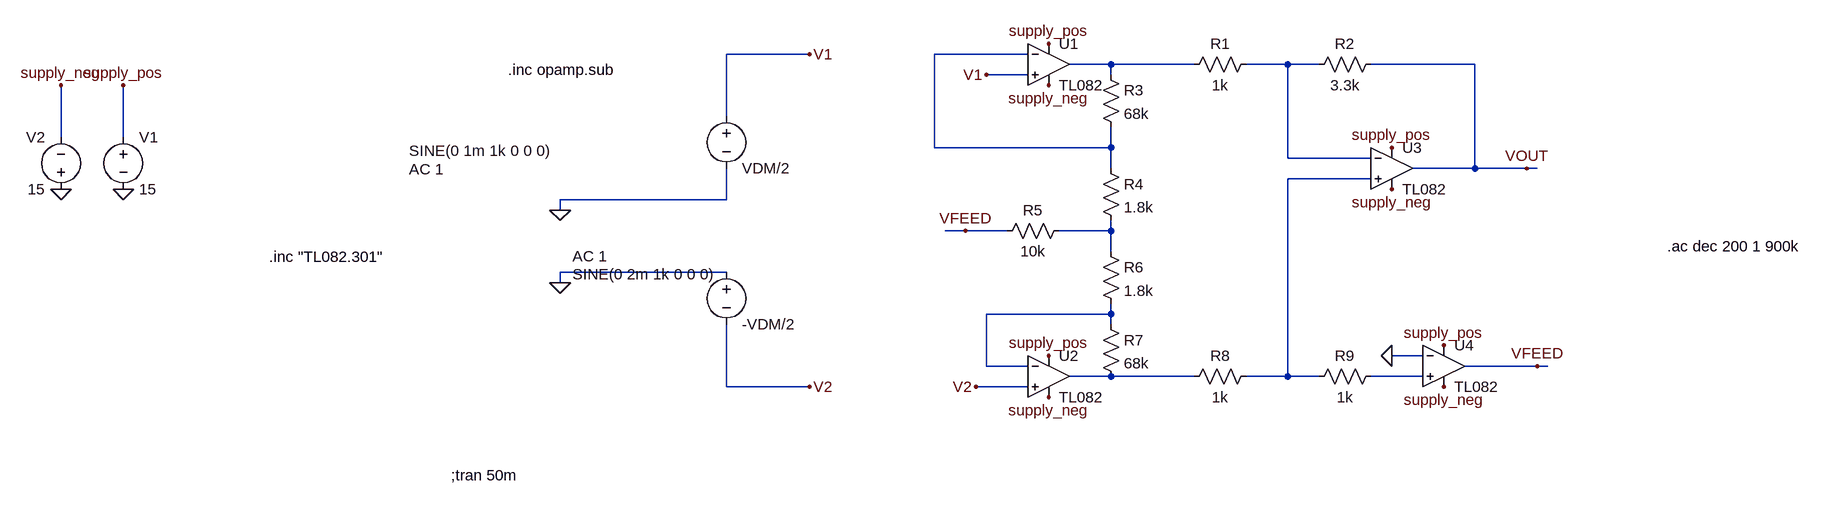
[diagram p0: schematic ej3_simulacion_no_ideal.asc]
ej3_simulacion_no_ideal.asc, the LTspice schematic file:
Version 4
SHEET 1 1232 704
WIRE -304 0 -432 0
WIRE 32 0 -112 0
WIRE 160 16 96 16
WIRE 288 16 160 16
WIRE 432 16 368 16
WIRE 480 16 432 16
WIRE 720 16 560 16
WIRE 32 32 -32 32
WIRE 160 32 160 16
WIRE -432 96 -432 0
WIRE -1456 128 -1456 48
WIRE -1360 128 -1360 48
WIRE -112 144 -112 0
WIRE 160 144 160 112
WIRE 160 144 -112 144
WIRE 432 160 432 16
WIRE 560 160 432 160
WIRE 160 176 160 144
WIRE 720 176 720 16
WIRE 720 176 624 176
WIRE 800 176 720 176
WIRE 816 176 800 176
WIRE 560 192 432 192
WIRE -432 224 -432 176
WIRE -432 224 -688 224
WIRE -688 240 -688 224
WIRE -64 272 -96 272
WIRE 0 272 -64 272
WIRE 160 272 160 256
WIRE 160 272 80 272
WIRE 160 304 160 272
WIRE -432 336 -688 336
WIRE -688 352 -688 336
WIRE 160 400 160 384
WIRE 160 400 -32 400
WIRE 160 416 160 400
WIRE 640 464 592 464
WIRE -32 480 -32 400
WIRE 32 480 -32 480
WIRE 816 480 704 480
WIRE 832 480 816 480
WIRE 160 496 96 496
WIRE 288 496 160 496
WIRE 432 496 432 192
WIRE 432 496 368 496
WIRE 480 496 432 496
WIRE 640 496 560 496
WIRE -432 512 -432 416
WIRE -304 512 -432 512
WIRE 32 512 -48 512
FLAG -48 512 V2
FLAG 816 480 VFEED
FLAG -64 272 VFEED
FLAG 800 176 VOUT
FLAG -304 0 V1
FLAG -304 512 V2
FLAG -688 240 0
FLAG -688 352 0
FLAG -32 32 V1
FLAG 592 464 0
FLAG -1456 208 0
FLAG -1360 208 0
FLAG -1360 48 supply_pos
FLAG -1456 48 supply_neg
FLAG 672 448 supply_pos
FLAG 672 512 supply_neg
FLAG 592 208 supply_neg
FLAG 592 144 supply_pos
FLAG 64 464 supply_pos
FLAG 64 -16 supply_pos
FLAG 64 48 supply_neg
FLAG 64 528 supply_neg
SYMBOL res 144 16 R0
SYMATTR InstName R3
SYMATTR Value 68k
SYMBOL res 144 160 R0
SYMATTR InstName R4
SYMATTR Value 1.8k
SYMBOL res 144 288 R0
SYMATTR InstName R6
SYMATTR Value 1.8k
SYMBOL res 144 400 R0
SYMATTR InstName R7
SYMATTR Value 68k
SYMBOL res 384 0 R90
WINDOW 0 0 56 VBottom 2
WINDOW 3 32 56 VTop 2
SYMATTR InstName R1
SYMATTR Value 1k
SYMBOL res 384 480 R90
WINDOW 0 0 56 VBottom 2
WINDOW 3 32 56 VTop 2
SYMATTR InstName R8
SYMATTR Value 1k
SYMBOL res 576 0 R90
WINDOW 0 0 56 VBottom 2
WINDOW 3 32 56 VTop 2
SYMATTR InstName R2
SYMATTR Value 3.3k
SYMBOL res 576 480 R90
WINDOW 0 0 56 VBottom 2
WINDOW 3 32 56 VTop 2
SYMATTR InstName R9
SYMATTR Value 1k
SYMBOL res 96 256 R90
WINDOW 0 0 56 VBottom 2
WINDOW 3 32 56 VTop 2
SYMATTR InstName R5
SYMATTR Value 10k
SYMBOL voltage -432 80 R0
WINDOW 0 24 96 Left 2
WINDOW 3 -488 69 Left 2
WINDOW 123 -488 97 Left 2
WINDOW 39 0 0 Left 2
SYMATTR InstName VDM/2
SYMATTR Value SINE(0 1m 1k 0 0 0)
SYMATTR Value2 AC 1
SYMBOL voltage -432 320 R0
WINDOW 0 24 96 Left 2
WINDOW 3 -237 19 Left 2
WINDOW 123 -237 -9 Left 2
WINDOW 39 0 0 Left 2
SYMATTR InstName -VDM/2
SYMATTR Value SINE(0 2m 1k 0 0 0)
SYMATTR Value2 AC 1
SYMBOL Opamps\\opamp2 592 112 R0
SYMATTR InstName U3
SYMATTR Value TL082
SYMBOL Opamps\\opamp2 672 416 R0
SYMATTR InstName U4
SYMATTR Value TL082
SYMBOL voltage -1360 112 R0
WINDOW 123 0 0 Left 2
WINDOW 39 0 0 Left 2
SYMATTR InstName V1
SYMATTR Value 15
SYMBOL voltage -1456 224 R180
WINDOW 0 24 96 Left 2
WINDOW 3 24 16 Left 2
WINDOW 123 0 0 Left 2
WINDOW 39 0 0 Left 2
SYMATTR InstName V2
SYMATTR Value 15
SYMBOL Opamps\\opamp2 64 -48 R0
SYMATTR InstName U1
SYMATTR Value TL082
SYMBOL Opamps\\opamp2 64 432 R0
SYMATTR InstName U2
SYMATTR Value TL082
TEXT -856 648 Left 2 !;tran 50m
TEXT -768 24 Left 2 !.inc opamp.sub
TEXT -1136 312 Left 2 !.inc "TL082.301"
TEXT 1016 296 Left 2 !.ac dec 200 1 900k

The netlist it stands for:
* ej3_simulacion_no_ideal.asc
R3 N002 N001 68k
R4 N001 N005 1.8k
R6 N005 N006 1.8k
R7 N006 N007 68k
R1 N003 N002 1k
R8 N004 N007 1k
R2 VOUT N003 3.3k
R9 N008 N004 1k
R5 N005 VFEED 10k
VDM/2 V1 0 SINE(0 1m 1k 0 0 0) AC 1
V§-VDM/2 0 V2 SINE(0 2m 1k 0 0 0) AC 1
XU3 N004 N003 supply_pos supply_neg VOUT TL082  ; pins In+ In- V+ V- OUT
XU4 N008 0 supply_pos supply_neg VFEED TL082  ; pins In+ In- V+ V- OUT
V1 supply_pos 0 15
V2 0 supply_neg 15
XU1 V1 N001 supply_pos supply_neg N002 TL082  ; pins In+ In- V+ V- OUT
XU2 V2 N006 supply_pos supply_neg N007 TL082  ; pins In+ In- V+ V- OUT
;tran 50m
.inc opamp.sub
.inc "TL082.301"
.ac dec 200 1 900k
.backanno
.end